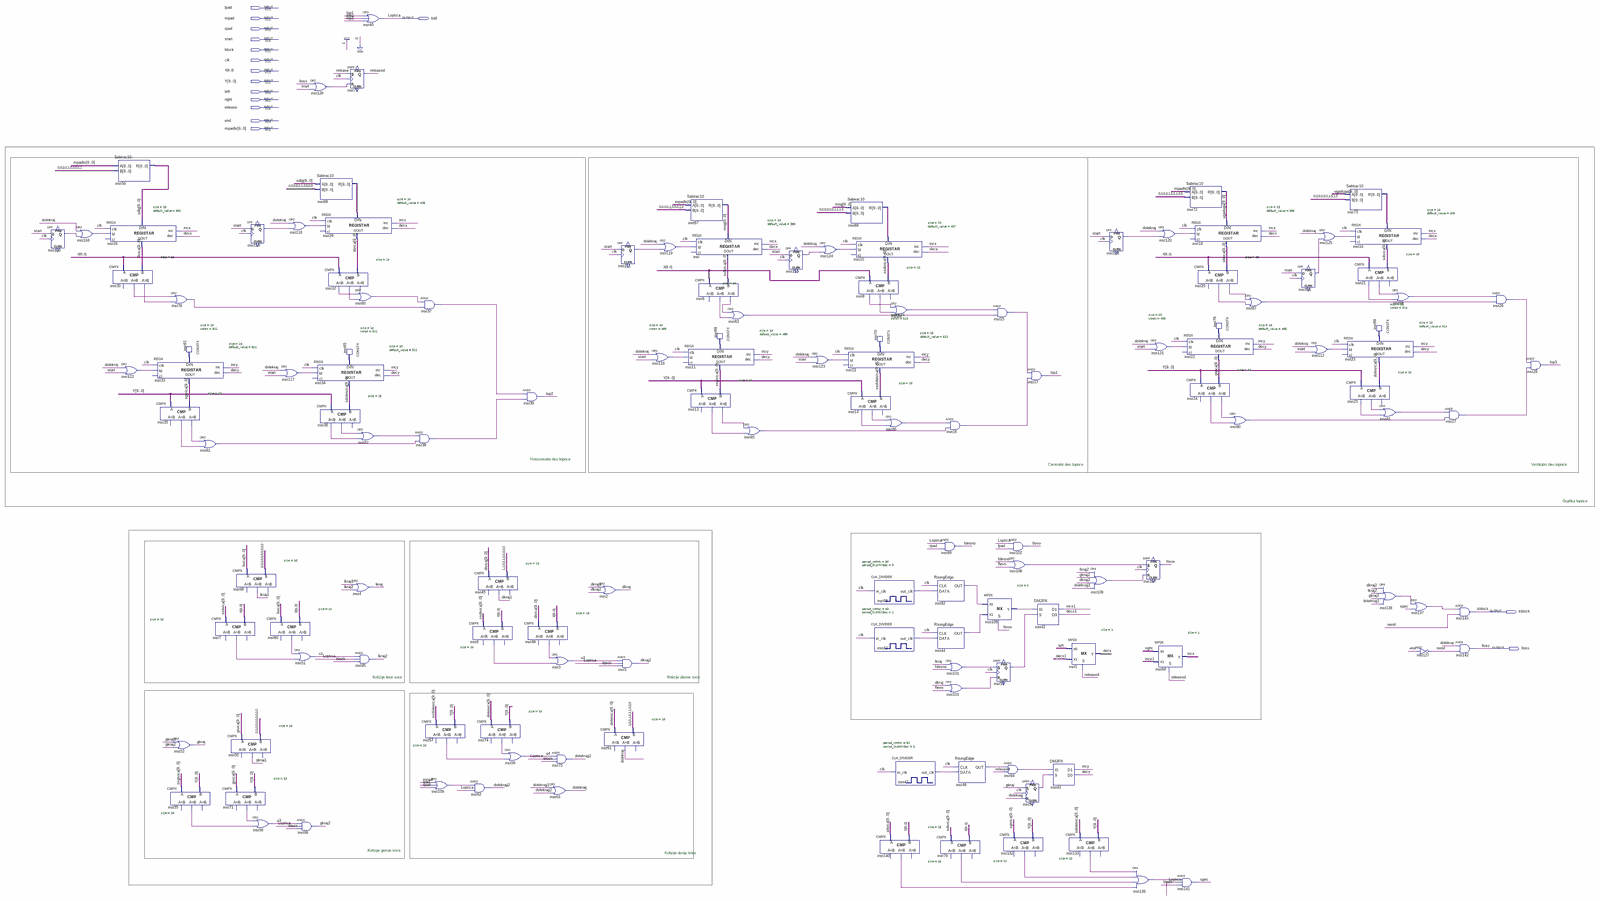
[diagram p0: schematic sheet, whole]
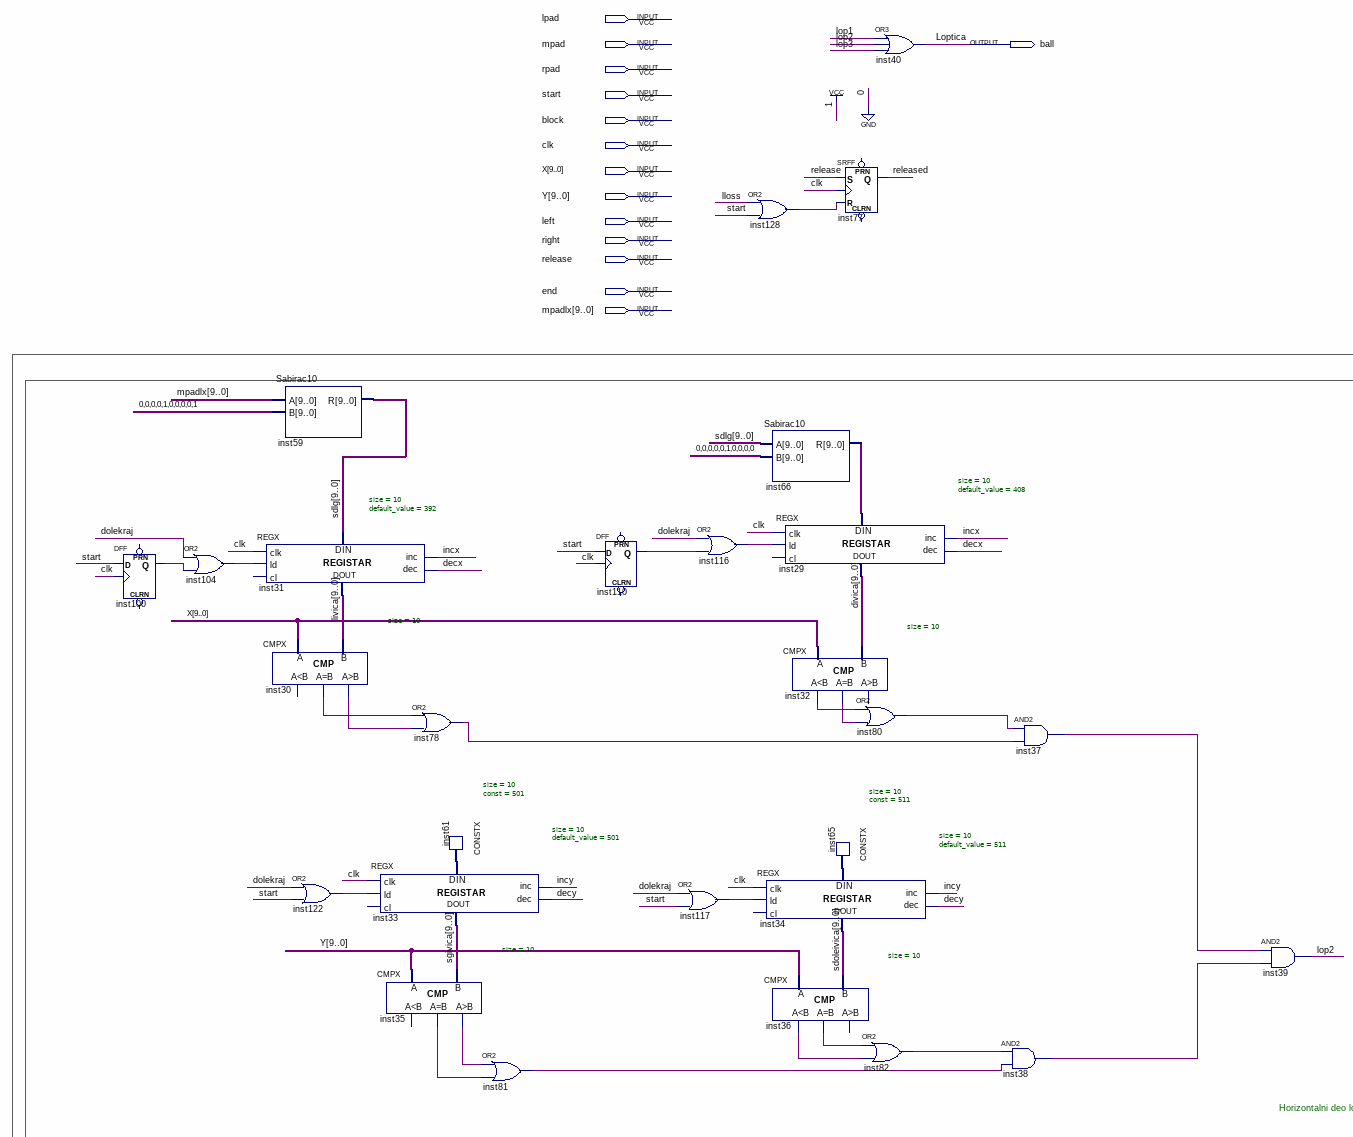
[diagram p1: schematic sheet, upper left part]
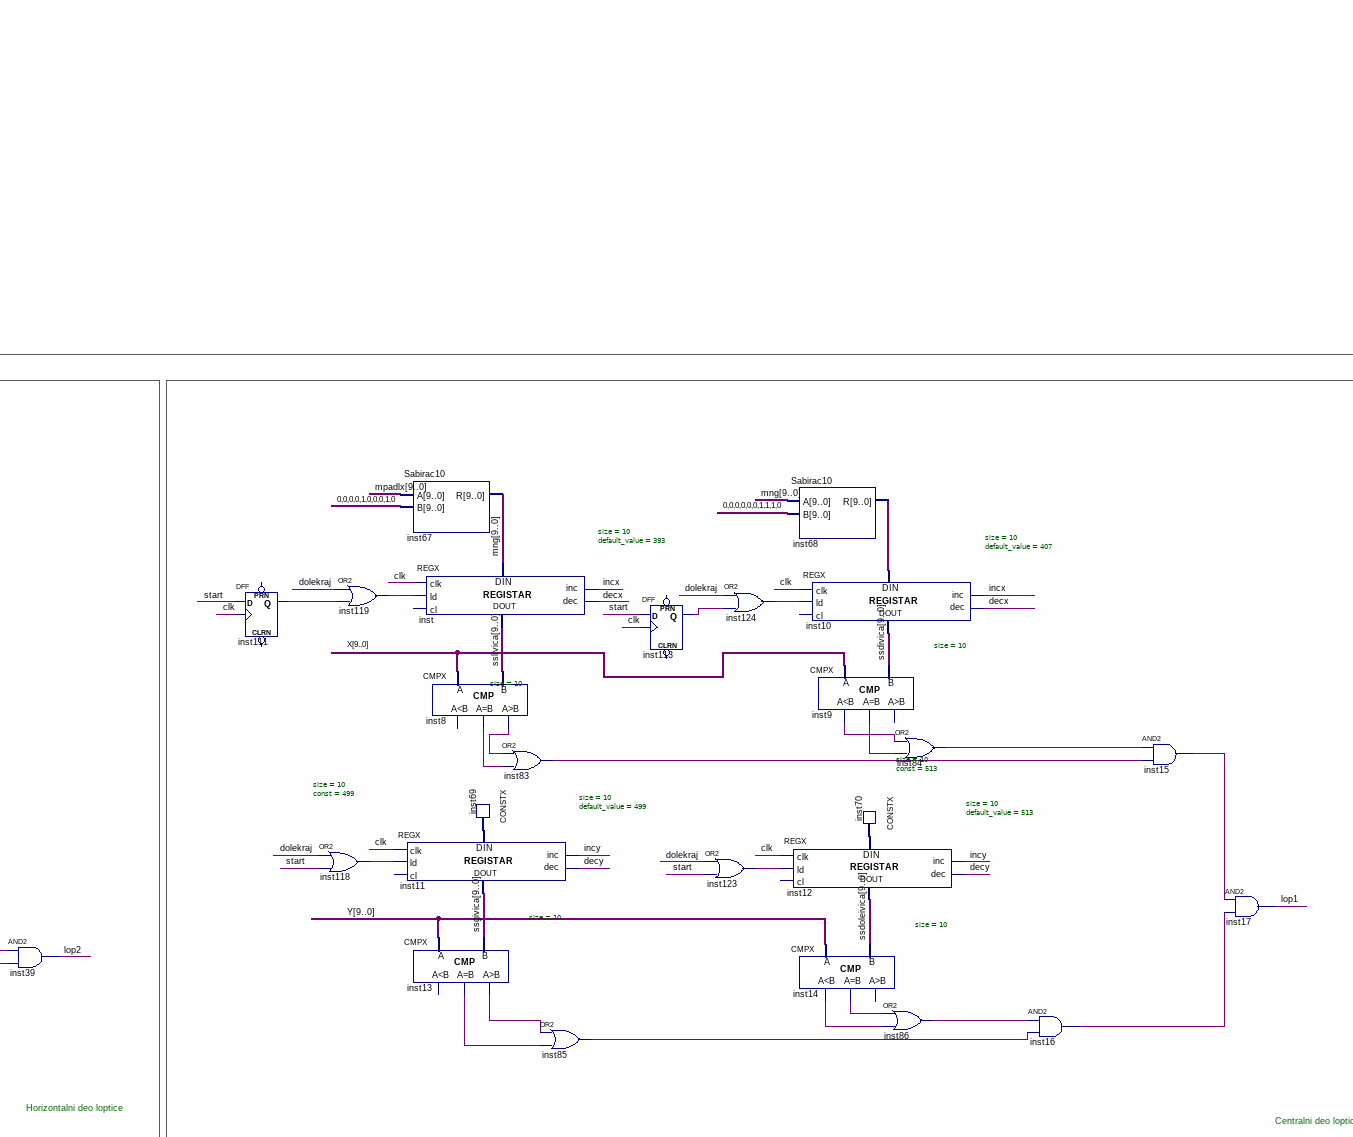
[diagram p2: schematic sheet, upper centre part]
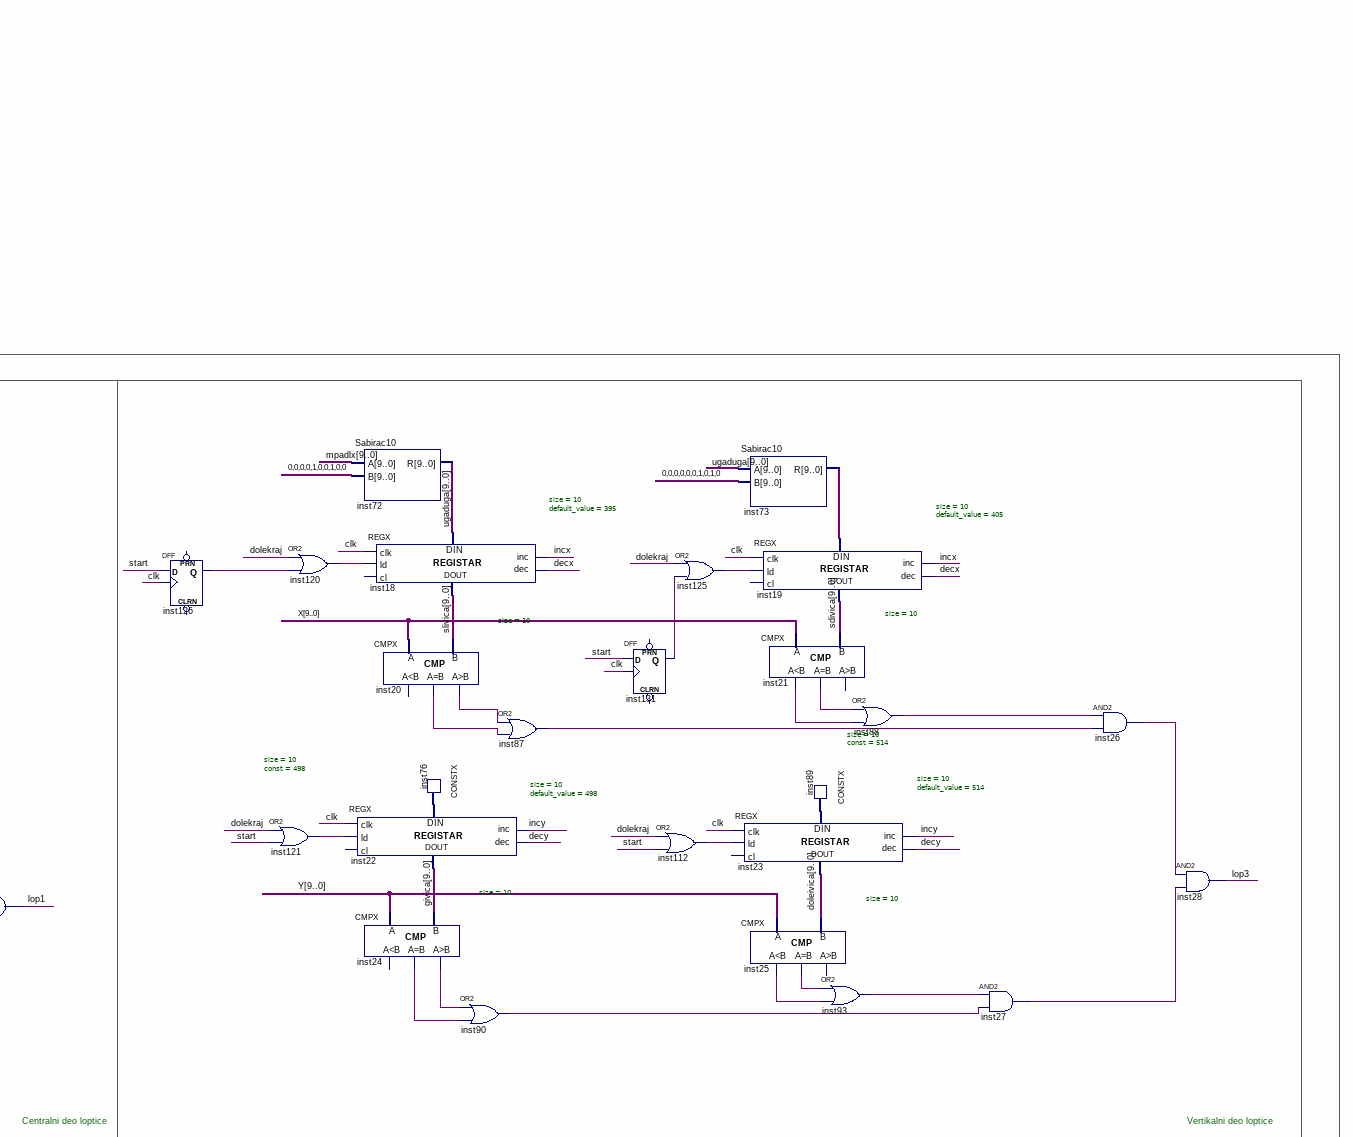
[diagram p3: schematic sheet, upper right part]
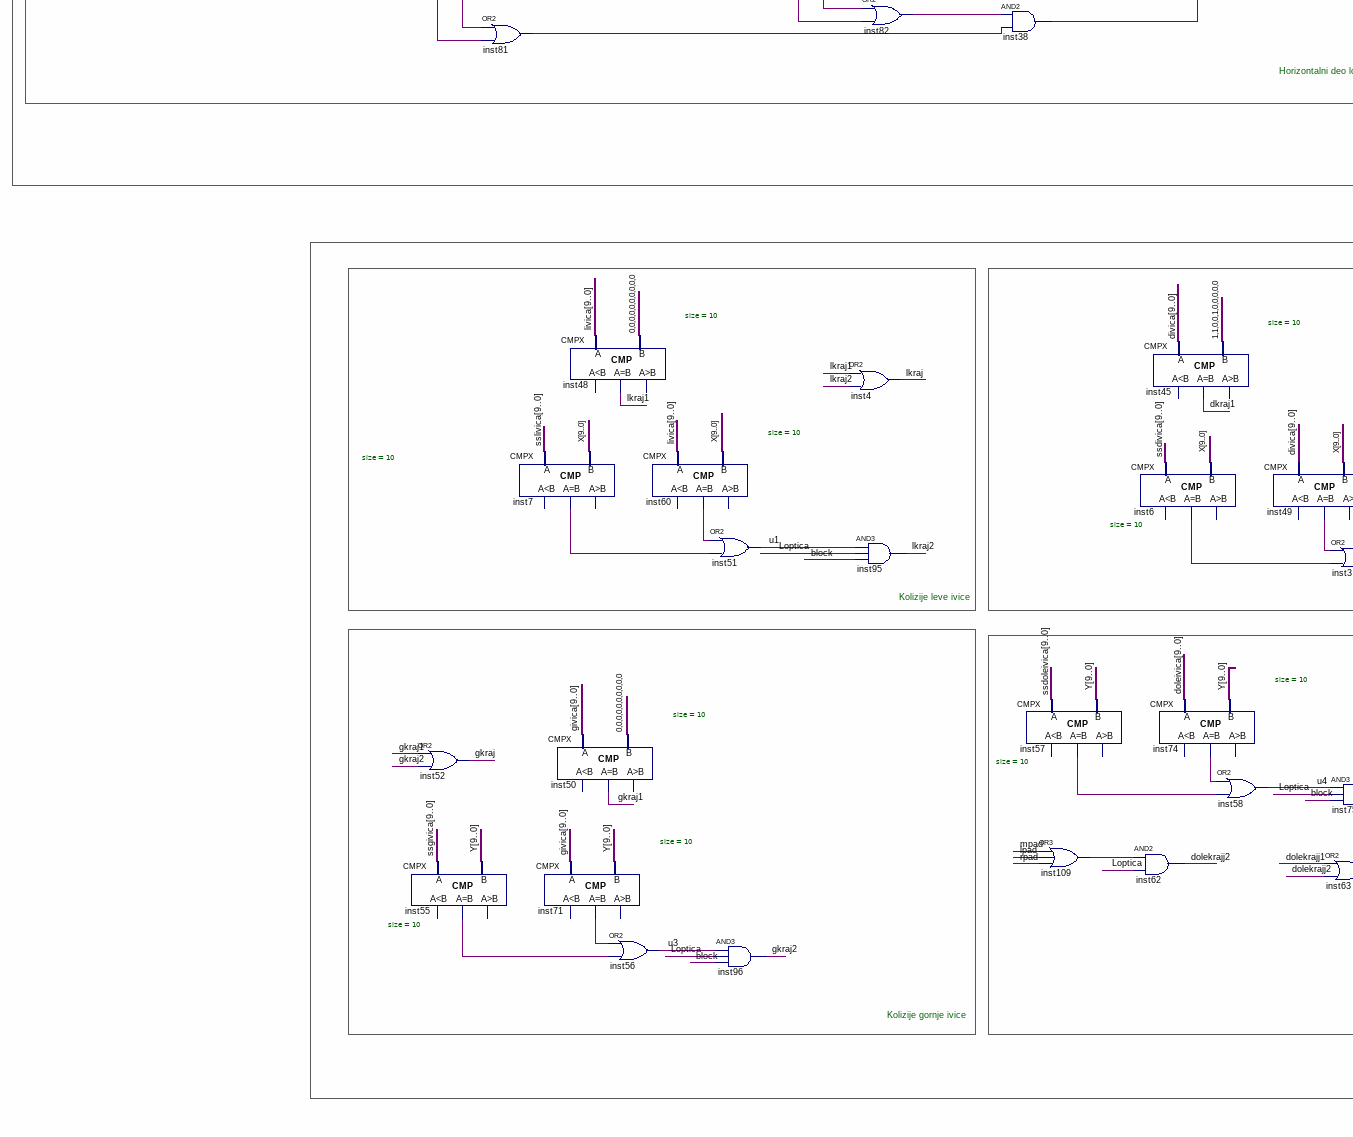
[diagram p4: schematic sheet, lower left part]
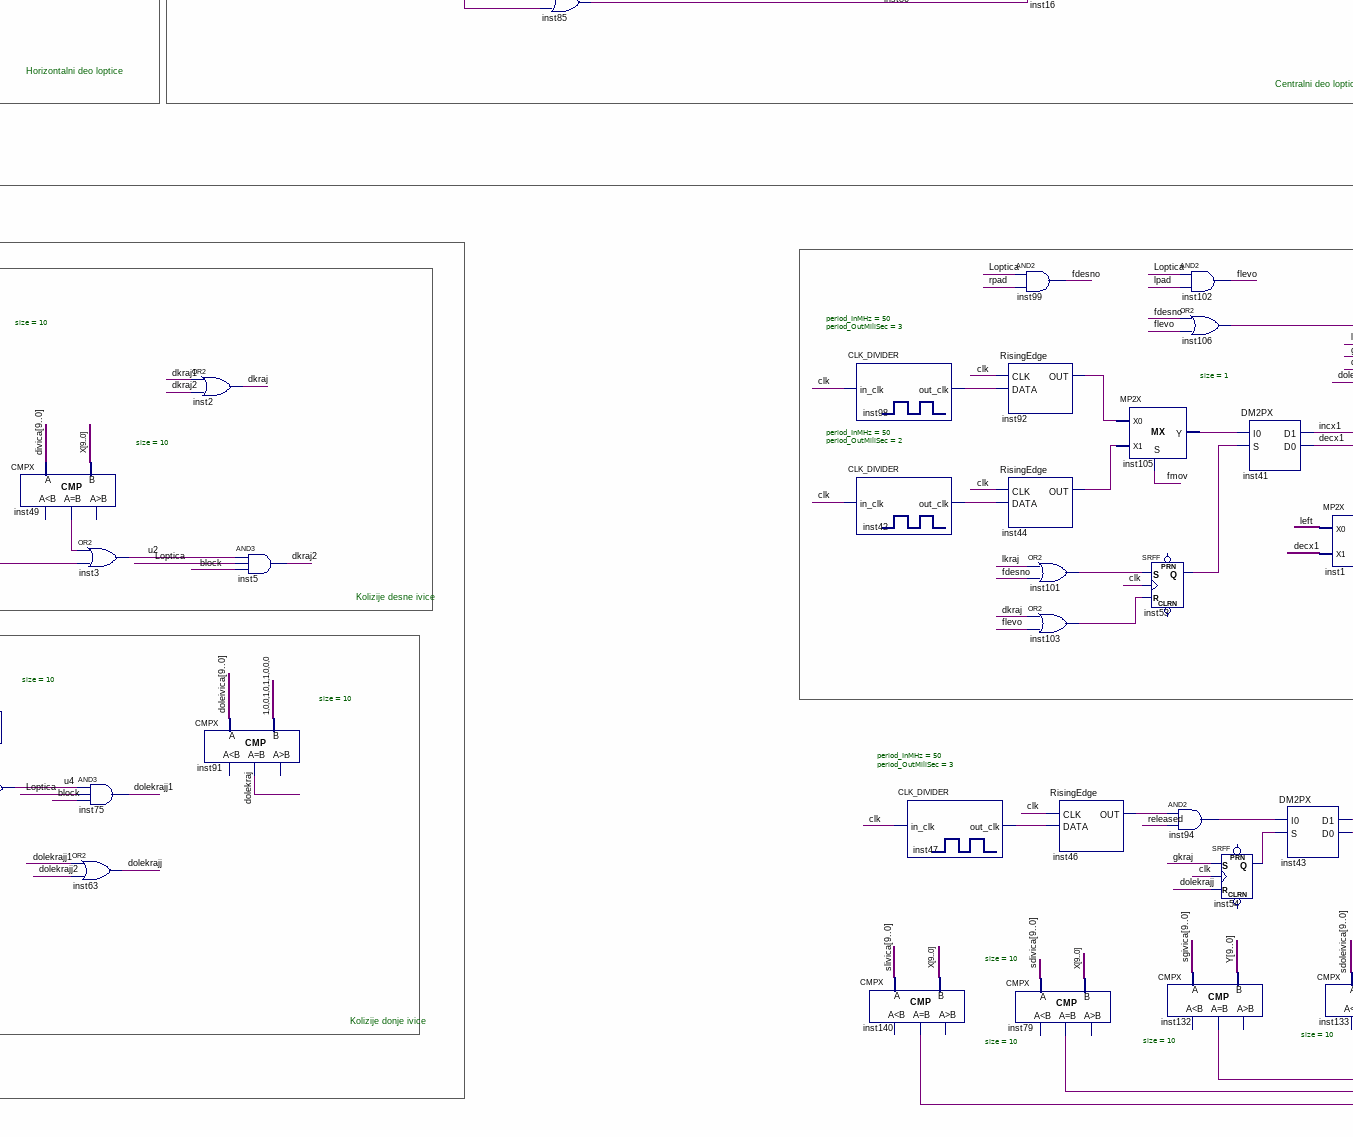
[diagram p5: schematic sheet, lower centre part]
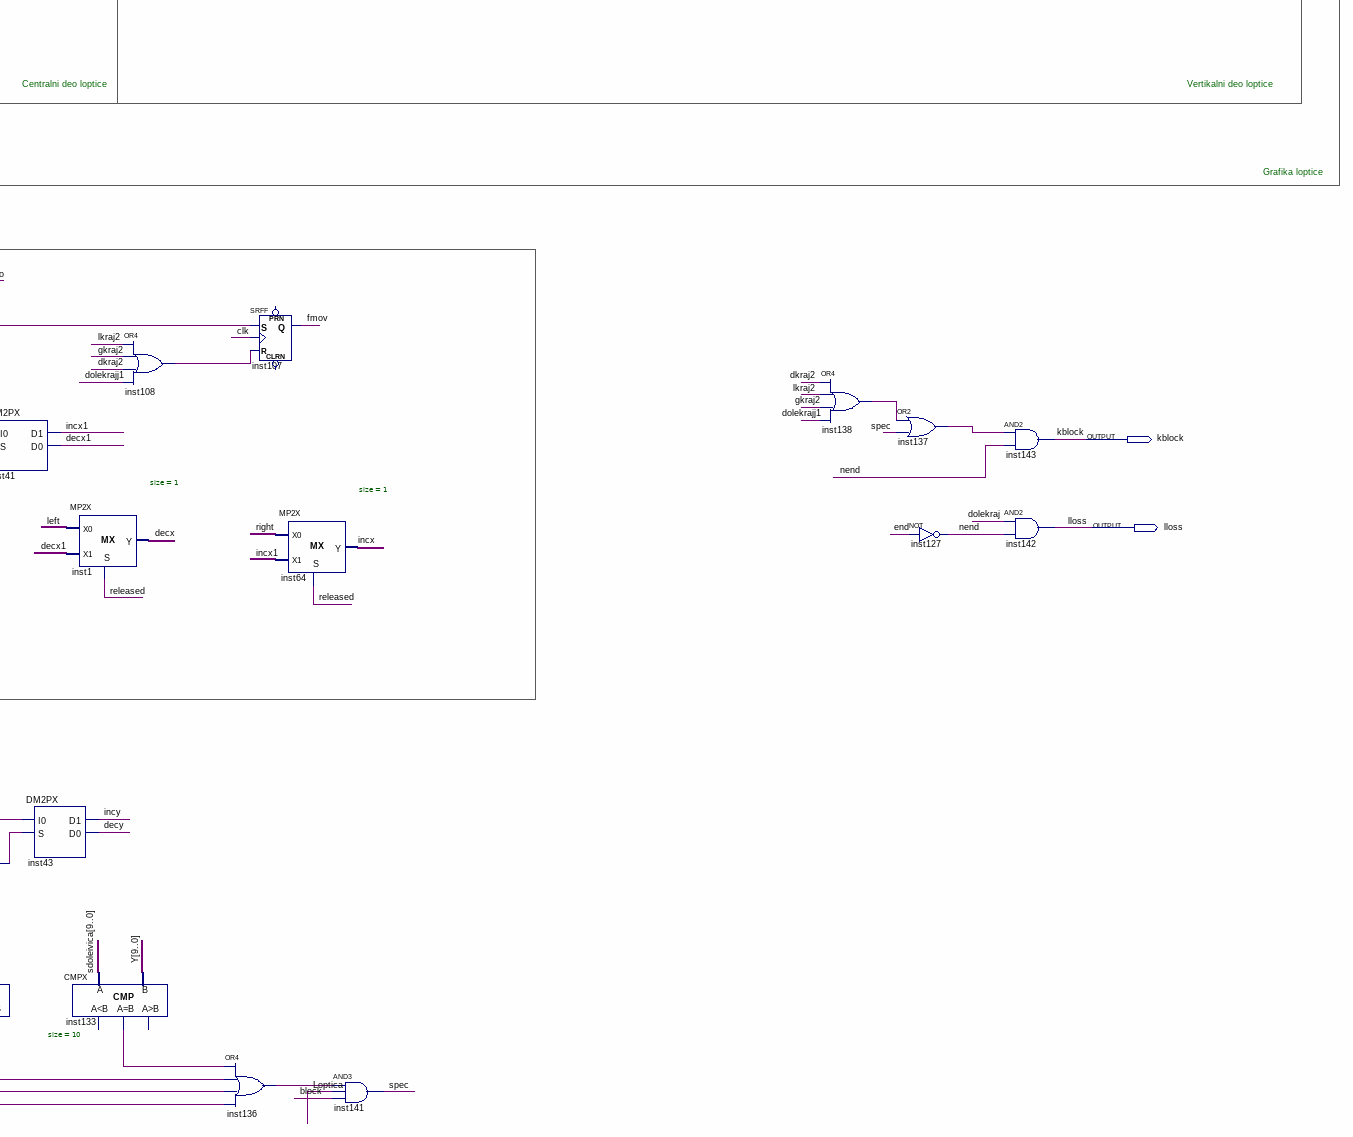
[diagram p6: schematic sheet, lower right part]
// Quartus schematic Loptica.bdf as structural Verilog: 136 symbols, 16 pins
module Loptica (
  input  lpad,
  input  mpad,
  input  rpad,
  input  start,
  input  block,
  input  clk,
  input  [9:0] X,
  input  [9:0] Y,
  input  left,
  input  right,
  input  \release ,
  input  \end ,
  input  [9:0] mpadlx,
  output ball,
  output kblock,
  output lloss
);

  wire decx, decx1, decy, dkraj, dkraj1, dkraj2, dolekraj, dolekrajj, dolekrajj1, dolekrajj2, fdesno, flevo,
       fmov, gkraj, gkraj1, gkraj2, incx, incx1, incy, inst6_eq, inst7_eq, inst8_eq, inst8_gr, inst9_eq,
       inst9_ls, inst13_eq, inst13_gr, inst14_eq, inst14_ls, inst15_out, inst16_out, inst20_eq, inst20_gr,
       inst21_eq, inst21_ls, inst24_eq, inst24_gr, inst25_eq, inst25_ls, inst26_out, inst27_out, inst30_eq,
       inst30_gr, inst32_eq, inst32_ls, inst35_eq, inst35_gr, inst36_eq, inst36_ls, inst37_out, inst38_out,
       inst42_out_clk, inst44_out, inst46_out, inst47_out_clk, inst49_eq, inst53_q, inst54_q, inst55_eq,
       inst57_eq, inst60_eq, inst71_eq, inst74_eq, inst78_out, inst79_eq, inst80_out, inst81_out, inst82_out,
       inst83_out, inst84_out, inst85_out, inst86_out, inst87_out, inst88_out, inst90_out, inst92_out,
       inst93_out, inst94_out, inst98_out_clk, inst100_q, inst101_out, inst103_out, inst104_out, inst105_y,
       inst106_out, inst108_out, inst109_out, inst110_q, inst111_q, inst112_out, inst113_q, inst116_out,
       inst117_out, inst118_out, inst119_out, inst120_out, inst121_out, inst122_out, inst123_out,
       inst124_out, inst125_out, inst126_q, inst128_out, inst131_q, inst132_eq, inst133_eq, inst136_out,
       inst137_out, inst138_out, inst140_eq, lkraj, lkraj1, lkraj2, lop1, lop2, lop3, nend, released, spec,
       u1, u2, u3, u4;
  wire [9:0] divica, doleivica, givica, inst61_data, inst65_data, inst66_r, inst68_r, inst69_data,
       inst70_data, inst73_r, inst76_data, inst89_data, livica, mng, sdivica, sdlg, sdoleivica, sgivica,
       slivica, ssdivica, ssdoleivica, ssgivica, sslivica, ugaduga;

  DFF inst100 (.CLK(clk), .D(start), .Q(inst100_q));  // open: CLRN, PRN
  or inst104 (inst104_out, dolekraj, inst100_q);
  Sabirac10 inst59 (.A(mpadlx), .B(10'b0000100001), .R(sdlg));
  REGX #(.size(10), .default_value(392)) inst31 (
    .clk(clk), .ld(inst104_out), .inc(incx), .dec(decx), .data_in(sdlg), .data_out(livica));  // open: cl
  CMPX #(.size(10)) inst30 (.A(X), .B(livica), .eq(inst30_eq), .gr(inst30_gr));  // open: ls
  or inst122 (inst122_out, dolekraj, start);
  REGX #(.size(10), .default_value(501)) inst33 (
    .clk(clk), .ld(inst122_out), .inc(incy), .dec(decy), .data_in(inst61_data), .data_out(sgivica));  // open: cl
  CMPX #(.size(10)) inst35 (.A(Y), .B(sgivica), .eq(inst35_eq), .gr(inst35_gr));  // open: ls
  or inst78 (inst78_out, inst30_eq, inst30_gr);
  or inst52 (gkraj, gkraj1, gkraj2);
  CMPX #(.size(10)) inst55 (.A(ssgivica), .B(Y), .eq(inst55_eq));  // open: ls, gr
  CONSTX #(.size(10), .\const (501)) inst61 (.data(inst61_data));
  or inst81 (inst81_out, inst35_gr, inst35_eq);
  CMPX #(.size(10)) inst7 (.A(sslivica), .B(X), .eq(inst7_eq));  // open: ls, gr
  CMPX #(.size(10)) inst48 (.A(livica), .B({10{1'b0}}), .eq(lkraj1));  // open: ls, gr
  CMPX #(.size(10)) inst50 (.A(givica), .B({10{1'b0}}), .eq(gkraj1));  // open: ls, gr
  CMPX #(.size(10)) inst71 (.A(givica), .B(Y), .eq(inst71_eq));  // open: ls, gr
  DFF inst110 (.CLK(clk), .D(start), .Q(inst110_q));  // open: CLRN, PRN
  or inst56 (u3, inst71_eq, inst55_eq);
  or inst117 (inst117_out, dolekraj, start);
  CMPX #(.size(10)) inst60 (.A(livica), .B(X), .eq(inst60_eq));  // open: ls, gr
  or inst116 (inst116_out, dolekraj, inst110_q);
  or inst51 (u1, inst60_eq, inst7_eq);
  and inst96 (gkraj2, u3, ball, block);
  or inst128 (inst128_out, lloss, start);
  Sabirac10 inst66 (.A(sdlg), .B(10'b0000010000), .R(inst66_r));
  REGX #(.size(10), .default_value(408)) inst29 (
    .clk(clk), .ld(inst116_out), .inc(incx), .dec(decx), .data_in(inst66_r), .data_out(divica));  // open: cl
  CMPX #(.size(10)) inst32 (.A(X), .B(divica), .ls(inst32_ls), .eq(inst32_eq));  // open: gr
  REGX #(.size(10), .default_value(511)) inst34 (
    .clk(clk), .ld(inst117_out), .inc(incy), .dec(decy), .data_in(inst65_data), .data_out(sdoleivica));  // open: cl
  CMPX #(.size(10)) inst36 (.A(Y), .B(sdoleivica), .ls(inst36_ls), .eq(inst36_eq));  // open: gr
  CONSTX #(.size(10), .\const (511)) inst65 (.data(inst65_data));
  or inst40 (ball, lop1, lop2, lop3);
  SRFF inst77 (.S(\release ), .R(inst128_out), .CLK(clk), .Q(released));  // open: PRN, CLRN
  or inst80 (inst80_out, inst32_ls, inst32_eq);
  or inst82 (inst82_out, inst36_eq, inst36_ls);
  or inst4 (lkraj, lkraj1, lkraj2);
  and inst95 (lkraj2, u1, ball, block);
  and inst37 (inst37_out, inst80_out, inst78_out);
  and inst38 (inst38_out, inst82_out, inst81_out);
  CMPX #(.size(10)) inst57 (.A(ssdoleivica), .B(Y), .eq(inst57_eq));  // open: ls, gr
  or inst109 (inst109_out, mpad, lpad, rpad);
  CMPX #(.size(10)) inst6 (.A(ssdivica), .B(X), .eq(inst6_eq));  // open: ls, gr
  and inst62 (dolekrajj2, inst109_out, ball);
  CMPX #(.size(10)) inst45 (.A(divica), .B(10'b1100100000), .eq(dkraj1));  // open: ls, gr
  CMPX #(.size(10)) inst74 (.A(doleivica), .B(Y), .eq(inst74_eq));  // open: ls, gr
  or inst58 (u4, inst74_eq, inst57_eq);
  and inst39 (lop2, inst37_out, inst38_out);
  CMPX #(.size(10)) inst49 (.A(divica), .B(X), .eq(inst49_eq));  // open: ls, gr
  or inst3 (u2, inst49_eq, inst6_eq);
  and inst75 (dolekrajj1, u4, ball, block);
  or inst63 (dolekrajj, dolekrajj1, dolekrajj2);
  DFF inst111 (.CLK(clk), .D(start), .Q(inst111_q));  // open: CLRN, PRN
  or inst2 (dkraj, dkraj1, dkraj2);
  and inst5 (dkraj2, u2, ball, block);
  CMPX #(.size(10)) inst91 (.A(doleivica), .B(10'b1001011000), .eq(dolekraj));  // open: ls, gr
  or inst119 (inst119_out, dolekraj, inst111_q);
  or inst118 (inst118_out, dolekraj, start);
  Sabirac10 inst67 (.A(mpadlx), .B(10'b0000100010), .R(mng));
  REGX #(.size(10), .default_value(393)) inst (
    .clk(clk), .ld(inst119_out), .inc(incx), .dec(decx), .data_in(mng), .data_out(sslivica));  // open: cl
  CMPX #(.size(10)) inst8 (.A(X), .B(sslivica), .eq(inst8_eq), .gr(inst8_gr));  // open: ls
  REGX #(.size(10), .default_value(499)) inst11 (
    .clk(clk), .ld(inst118_out), .inc(incy), .dec(decy), .data_in(inst69_data), .data_out(ssgivica));  // open: cl
  CMPX #(.size(10)) inst13 (.A(Y), .B(ssgivica), .eq(inst13_eq), .gr(inst13_gr));  // open: ls
  CONSTX #(.size(10), .\const (499)) inst69 (.data(inst69_data));
  or inst83 (inst83_out, inst8_gr, inst8_eq);
  or inst85 (inst85_out, inst13_gr, inst13_eq);
  DFF inst113 (.CLK(clk), .D(start), .Q(inst113_q));  // open: CLRN, PRN
  or inst124 (inst124_out, dolekraj, inst113_q);
  or inst123 (inst123_out, dolekraj, start);
  Sabirac10 inst68 (.A(mng), .B(10'b0000001110), .R(inst68_r));
  REGX #(.size(10), .default_value(513)) inst12 (
    .clk(clk), .ld(inst123_out), .inc(incy), .dec(decy), .data_in(inst70_data), .data_out(ssdoleivica));  // open: cl
  CMPX #(.size(10)) inst14 (.A(Y), .B(ssdoleivica), .ls(inst14_ls), .eq(inst14_eq));  // open: gr
  REGX #(.size(10), .default_value(407)) inst10 (
    .clk(clk), .ld(inst124_out), .inc(incx), .dec(decx), .data_in(inst68_r), .data_out(ssdivica));  // open: cl
  CMPX #(.size(10)) inst9 (.A(X), .B(ssdivica), .ls(inst9_ls), .eq(inst9_eq));  // open: gr
  CLK_DIVIDER #(.period_InMHz(50), .period_OutMiliSec(3)) inst98 (.in_clk(clk), .out_clk(inst98_out_clk));
  CLK_DIVIDER #(.period_InMHz(50), .period_OutMiliSec(2)) inst42 (.in_clk(clk), .out_clk(inst42_out_clk));
  or inst84 (inst84_out, inst9_ls, inst9_eq);
  CONSTX #(.size(10), .\const (513)) inst70 (.data(inst70_data));
  or inst86 (inst86_out, inst14_eq, inst14_ls);
  CLK_DIVIDER #(.period_InMHz(50), .period_OutMiliSec(3)) inst47 (.in_clk(clk), .out_clk(inst47_out_clk));
  CMPX #(.size(10)) inst140 (.A(slivica), .B(X), .eq(inst140_eq));  // open: ls, gr
  RisingEdge inst92 (.CLK(clk), .DATA(inst98_out_clk), .OUT(inst92_out));
  RisingEdge inst44 (.CLK(clk), .DATA(inst42_out_clk), .OUT(inst44_out));
  and inst16 (inst16_out, inst86_out, inst85_out);
  and inst99 (fdesno, ball, rpad);
  or inst101 (inst101_out, lkraj, fdesno);
  or inst103 (inst103_out, dkraj, flevo);
  RisingEdge inst46 (.CLK(clk), .DATA(inst47_out_clk), .OUT(inst46_out));
  CMPX #(.size(10)) inst79 (.A(sdivica), .B(X), .eq(inst79_eq));  // open: ls, gr
  and inst15 (inst15_out, inst84_out, inst83_out);
  MP2X #(.size(1)) inst105 (.S(fmov), .X0(inst92_out), .X1(inst44_out), .Y(inst105_y));
  SRFF inst53 (.S(inst101_out), .R(inst103_out), .CLK(clk), .Q(inst53_q));  // open: PRN, CLRN
  and inst102 (flevo, ball, lpad);
  or inst106 (inst106_out, fdesno, flevo);
  and inst94 (inst94_out, inst46_out, released);
  CMPX #(.size(10)) inst132 (.A(sgivica), .B(Y), .eq(inst132_eq));  // open: ls, gr
  and inst17 (lop1, inst15_out, inst16_out);
  DM2PX inst41 (.I0(inst105_y), .S(inst53_q), .D1(incx1), .D0(decx1));
  SRFF inst54 (.S(gkraj), .R(dolekrajj), .CLK(clk), .Q(inst54_q));  // open: PRN, CLRN
  DM2PX inst43 (.I0(inst94_out), .S(inst54_q), .D1(incy), .D0(decy));
  MP2X #(.size(1)) inst1 (.S(released), .X0(left), .X1(decx1), .Y(decx));
  CMPX #(.size(10)) inst133 (.A(sdoleivica), .B(Y), .eq(inst133_eq));  // open: ls, gr
  or inst108 (inst108_out, lkraj2, gkraj2, dkraj2, dolekrajj1);
  DFF inst126 (.CLK(clk), .D(start), .Q(inst126_q));  // open: CLRN, PRN
  SRFF inst107 (.S(inst106_out), .R(inst108_out), .CLK(clk), .Q(fmov));  // open: PRN, CLRN
  or inst136 (inst136_out, inst133_eq, inst132_eq, inst79_eq, inst140_eq);
  or inst120 (inst120_out, dolekraj, inst126_q);
  or inst121 (inst121_out, dolekraj, start);
  MP2X #(.size(1)) inst64 (.S(released), .X0(right), .X1(incx1), .Y(incx));
  Sabirac10 inst72 (.A(mpadlx), .B(10'b0000100100), .R(ugaduga));
  REGX #(.size(10), .default_value(498)) inst22 (
    .clk(clk), .ld(inst121_out), .inc(incy), .dec(decy), .data_in(inst76_data), .data_out(givica));  // open: cl
  CMPX #(.size(10)) inst24 (.A(Y), .B(givica), .eq(inst24_eq), .gr(inst24_gr));  // open: ls
  and inst141 (spec, inst136_out, ball, block);
  REGX #(.size(10), .default_value(395)) inst18 (
    .clk(clk), .ld(inst120_out), .inc(incx), .dec(decx), .data_in(ugaduga), .data_out(slivica));  // open: cl
  CMPX #(.size(10)) inst20 (.A(X), .B(slivica), .eq(inst20_eq), .gr(inst20_gr));  // open: ls
  CONSTX #(.size(10), .\const (498)) inst76 (.data(inst76_data));
  or inst87 (inst87_out, inst20_gr, inst20_eq);
  or inst90 (inst90_out, inst24_gr, inst24_eq);
  DFF inst131 (.CLK(clk), .D(start), .Q(inst131_q));  // open: CLRN, PRN
  or inst112 (inst112_out, dolekraj, start);
  or inst125 (inst125_out, dolekraj, inst131_q);
  Sabirac10 inst73 (.A(ugaduga), .B(10'b0000001010), .R(inst73_r));
  REGX #(.size(10), .default_value(405)) inst19 (
    .clk(clk), .ld(inst125_out), .inc(incx), .dec(decx), .data_in(inst73_r), .data_out(sdivica));  // open: cl
  CMPX #(.size(10)) inst21 (.A(X), .B(sdivica), .ls(inst21_ls), .eq(inst21_eq));  // open: gr
  REGX #(.size(10), .default_value(514)) inst23 (
    .clk(clk), .ld(inst112_out), .inc(incy), .dec(decy), .data_in(inst89_data), .data_out(doleivica));  // open: cl
  CMPX #(.size(10)) inst25 (.A(Y), .B(doleivica), .ls(inst25_ls), .eq(inst25_eq));  // open: gr
  CONSTX #(.size(10), .\const (514)) inst89 (.data(inst89_data));
  or inst88 (inst88_out, inst21_eq, inst21_ls);
  or inst93 (inst93_out, inst25_eq, inst25_ls);
  or inst138 (inst138_out, dkraj2, lkraj2, gkraj2, dolekrajj1);
  or inst137 (inst137_out, inst138_out, spec);
  not inst127 (nend, \end );
  and inst27 (inst27_out, inst93_out, inst90_out);
  and inst143 (kblock, inst137_out, nend);
  and inst142 (lloss, dolekraj, nend);
  and inst26 (inst26_out, inst88_out, inst87_out);
  and inst28 (lop3, inst26_out, inst27_out);

  // Other names for the same wires on the sheet: Loptica = ball

  // Notes on the sheet:
  //   Horizontalni deo loptice
  //   Centralni deo loptice
  //   Vertikalni deo loptice
  //   Grafika loptice
  //   Kolizije leve ivice
  //   Kolizije desne ivice
  //   Kolizije gornje ivice 
  //   Kolizije donje ivice
endmodule
